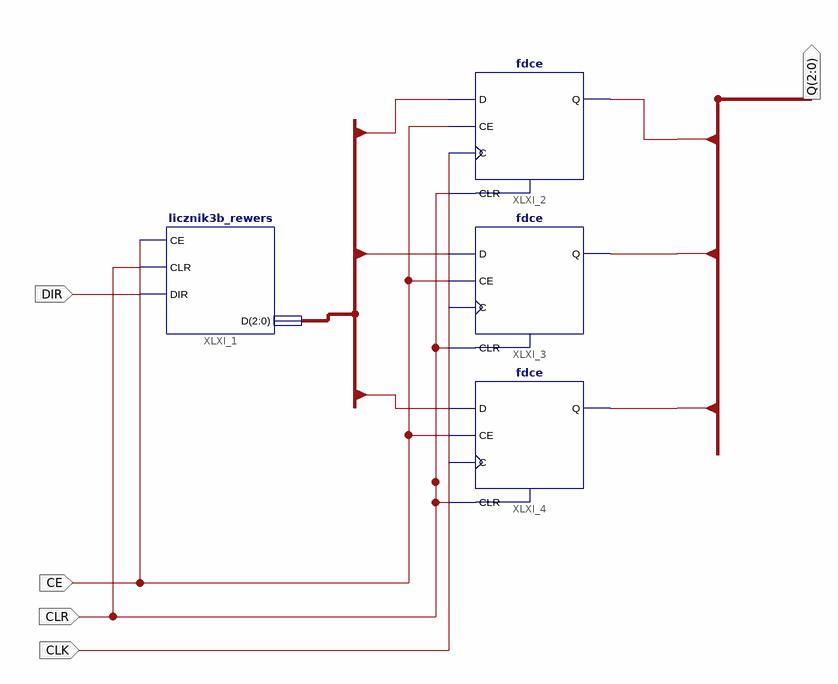
[diagram p0: schematic sheet 1]
// Xilinx ISE schematic licznik3bit_rewers_schemat.sch (xc9500xl) as structural Verilog: 4 symbols, 5 ports
module licznik3bit_rewers_schemat (
  input  DIR,
  input  CE,
  input  CLR,
  input  CLK,
  output [2:0] Q
);

  wire XLXN_5, XLXN_6, XLXN_7, XLXN_20, XLXN_21, XLXN_22;
  wire [2:0] XLXN_4;

  licznik3b_rewers XLXI_1 (.CE(CE), .CLR(CLR), .DIR(DIR), .D(XLXN_4));
  fdce XLXI_2 (.C(CLK), .CE(CE), .CLR(CLR), .D(XLXN_7), .Q(XLXN_22));
  fdce XLXI_3 (.C(CLK), .CE(CE), .CLR(CLR), .D(XLXN_6), .Q(XLXN_21));
  fdce XLXI_4 (.C(CLK), .CE(CE), .CLR(CLR), .D(XLXN_5), .Q(XLXN_20));
endmodule
